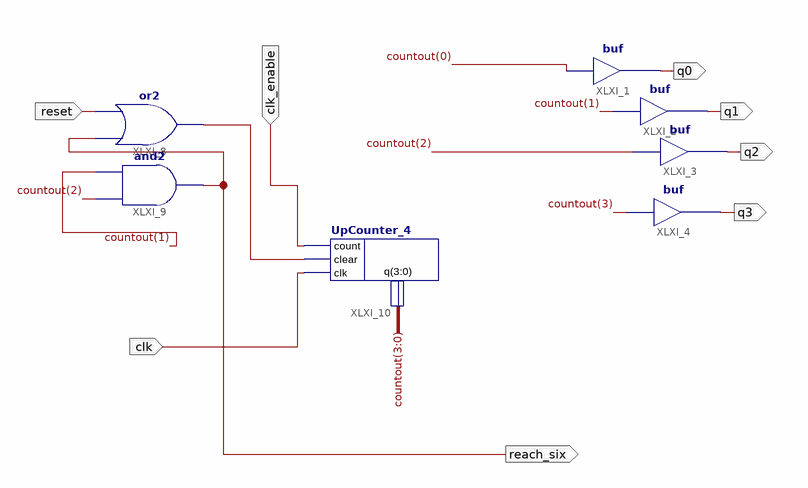
[diagram p0: schematic sheet 1]
// Xilinx ISE schematic Upcount_Modulo_6.sch (spartan3e) as structural Verilog: 7 symbols, 8 ports
module Upcount_Modulo_6 (
  input  clk,
  input  clk_enable,
  input  reset,
  output q0,
  output q1,
  output q2,
  output q3,
  output reach_six
);

  wire XLXN_25;
  wire [3:0] countout;

  buf XLXI_1 (q0, countout[0]);
  buf XLXI_2 (q1, countout[1]);
  buf XLXI_3 (q2, countout[2]);
  buf XLXI_4 (q3, countout[3]);
  or XLXI_8 (XLXN_25, reach_six, reset);
  and XLXI_9 (reach_six, countout[2], countout[1]);
  UpCounter_4 XLXI_10 (.clk(clk), .q(countout), .clear(XLXN_25), .count(clk_enable));
endmodule
